# EAGLE design ads1115_shiled (EAGLE 9.3.0)
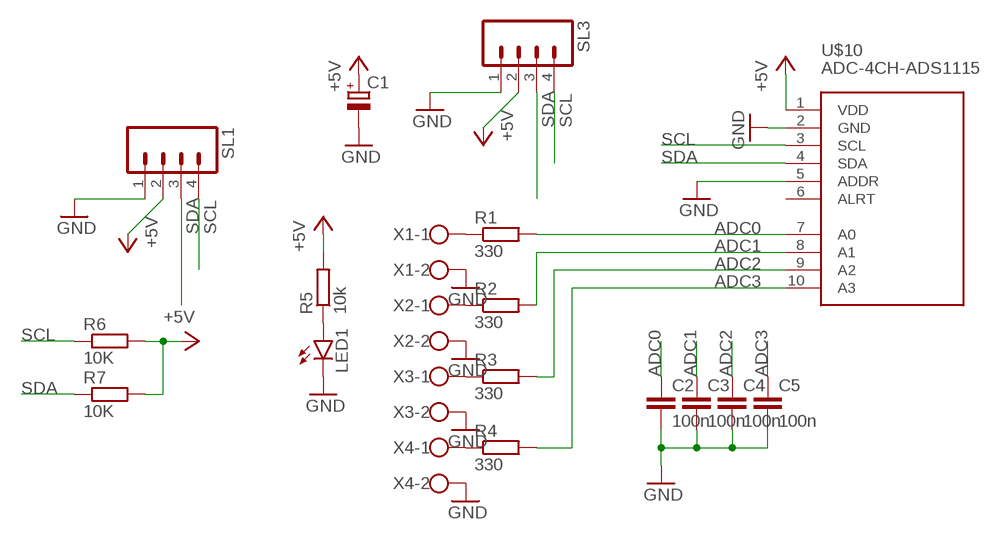
[diagram p0: schematic, sheet 1]

## Parts
C1  CPOL-EUE5-8.5  [E5-8,5]
C2  100n  C-EUC1206  [C1206]
C3  100n  C-EUC1206  [C1206]
C4  100n  C-EUC1206  [C1206]
C5  100n  C-EUC1206  [C1206]
LED1  LED3MM  [LED3MM]
R1  330  R-EU_M1206  [M1206]
R2  330  R-EU_M1206  [M1206]
R3  330  R-EU_M1206  [M1206]
R4  330  R-EU_M1206  [M1206]
R5  10k  R-EU_M1206  [M1206]
R6  10K  R-EU_M1206  [M1206]
R7  10K  R-EU_M1206  [M1206]
SL1  M04  [04P]
SL3  M04  [04P]
U$10  ADC-4CH-ADS1115  [ADC-4CH-ADS1115]
X1  W237-102  [W237-102]
X2  W237-102  [W237-102]
X3  W237-102  [W237-102]
X4  W237-102  [W237-102]

## Nets
+5V: C1.+ R5.2 R6.2 R7.2 SL1.2 SL3.2 U$10.1(VDD)
ADC0: C2.1 R1.2 U$10.7(A0)
ADC1: C3.1 R2.2 U$10.8(A1)
ADC2: C4.1 R3.2 U$10.9(A2)
ADC3: C5.1 R4.2 U$10.10(A3)
GND: C1.- C2.2 C3.2 C4.2 C5.2 LED1.K(C) SL1.1 SL3.1 U$10.2(GND) U$10.5(ADDR) X1.2 X2.2 X3.2 X4.2
N$1: R1.1 X1.1
N$2: R2.1 X2.1
N$3: R3.1 X3.1
N$4: R4.1 X4.1
N$5: LED1.A R5.1
SCL: R6.1 SL1.4 SL3.4 U$10.3(SCL)
SDA: R7.1 SL1.3 SL3.3 U$10.4(SDA)
Unconnected: U$10.6(ALRT)

## Library data of the parts
C1 = rcl:CPOL-EU: POLARIZED CAPACITOR, European symbol; SPICEPREFIX: C
C2-C5 = rcl:C-EU: CAPACITOR, European symbol; SPICEPREFIX: C
LED1 = led:LED: LED OSRAM: - CHIPLED LG R971, LG N971, LY N971, LG Q971, LY Q971, LO R971, LY R971 LH N974, LH R974 LS Q976, LO Q976, LY Q976 LO Q996 - Hyper CHIPLED LW Q18S LB Q993, LB Q99A, LB R99A - SideLED LS A670, LO A670, LY A670, LG A670, LP A670 LB A673, LV A673, LT A673, LW A673 LH A674 LY A675 LS A676, LA A676, LO A676, LY A676, LW A676 LS A679, LY A679, LG A679 - Hyper Micro SIDELED® LS Y876, LA Y876, LO Y876, LY Y876 LT Y87S - SmartLED LW L88C, LW L88S LB L89C, LB L89S, LG L890 LS L89K, LO L89K, LY L89K LS L896, LA L896, LO L896, LY L896 - TOPLED LS T670, LO T670, LY T670, LG T670, LP T670 LSG T670, LSP T670, LSY T670, LOP T670, LYG T670 LG T671, LOG T671, LSG T671 LB T673, LV T673, LT T673, LW T673 LH T674 LS T676, LA T676, LO T676, LY T676, LB T676, LH T676, LSB T676, LW T676 LB T67C, LV T67C, LT T67C, LS T67K, LO T67K, LY T67K, LW E67C LS E67B, LA E67B, LO E67B, LY E67B, LB E67C, LV E67C, LT E67C LW T67C LS T679, LY T679, LG T679 LS T770, LO T770, LY T770, LG T770, LP T770 LB T773, LV T773, LT T773, LW T773 LH T774 LS E675, LA E675, LY E675, LS T675 LS T776, LA T776, LO T776, LY T776, LB T776 LHGB T686 LT T68C, LB T68C - Hyper Mini TOPLED® LB M676 - Mini TOPLED Santana® LG M470 LS M47K, LO M47K, LY M47K Source: http://www.osram.convergy.de LUXEON: - LUMILED® LXK2-PW12-R00, LXK2-PW12-S00, LXK2-PW14-U00, LXK2-PW14-V00 LXK2-PM12-R00, LXK2-PM12-S00, LXK2-PM14-U00 LXK2-PE12-Q00, LXK2-PE12-R00, LXK2-PE12-S00, LXK2-PE14-T00, LXK2-PE14-U00 LXK2-PB12-K00, LXK2-PB12-L00, LXK2-PB12-M00, LXK2-PB14-N00, LXK2-PB14-P00, LXK2-PB14-Q00 LXK2-PR12-L00, LXK2-PR12-M00, LXK2-PR14-Q00, LXK2-PR14-R00 LXK2-PD12-Q00, LXK2-PD12-R00, LXK2-PD12-S00 LXK2-PH12-R00, LXK2-PH12-S00 LXK2-PL12-P00, LXK2-PL12-Q00, LXK2-PL12-R00 Source: www.luxeon.com KINGBRIGHT: KA-3528ASYC Source: www.kingbright.com
R1-R7 = rcl:R-EU_: RESISTOR, European symbol; SPICEPREFIX: R
SL1 SL3 = con-amp-quick:M04: AMP QUICK CONNECTOR; OC_FARNELL: unknown; OC_NEWARK: unknown
U$10 = diy-modules:ADC-4CH-ADS1115: 4 Channel 16-Bit Analog-to-Digital Converter based on ADS1115 chip Arduino ADS1115 Getting Started Tutorial is available here: http://henrysbench.capnfatz.com/henrys-bench/arduino-voltage-measurements/arduino-ads1115-module-getting-started-tutorial/ ADS1115 datasheet is available here: http://www.ti.com/lit/ds/symlink/ads1115.pdf Click here to find device on ebay.com <http://www.ebay.com/sch/ads1115+module>
X1-X4 = con-wago-500-edit:W237-102: WAGO SCREW CLAMP; MPN: 237-102; OC_FARNELL: unknown; OC_NEWARK: 70K9898

## Net classes
0 default: width 0.152 mm, drill 0.152 mm, clearance 0.762 mm

## Board
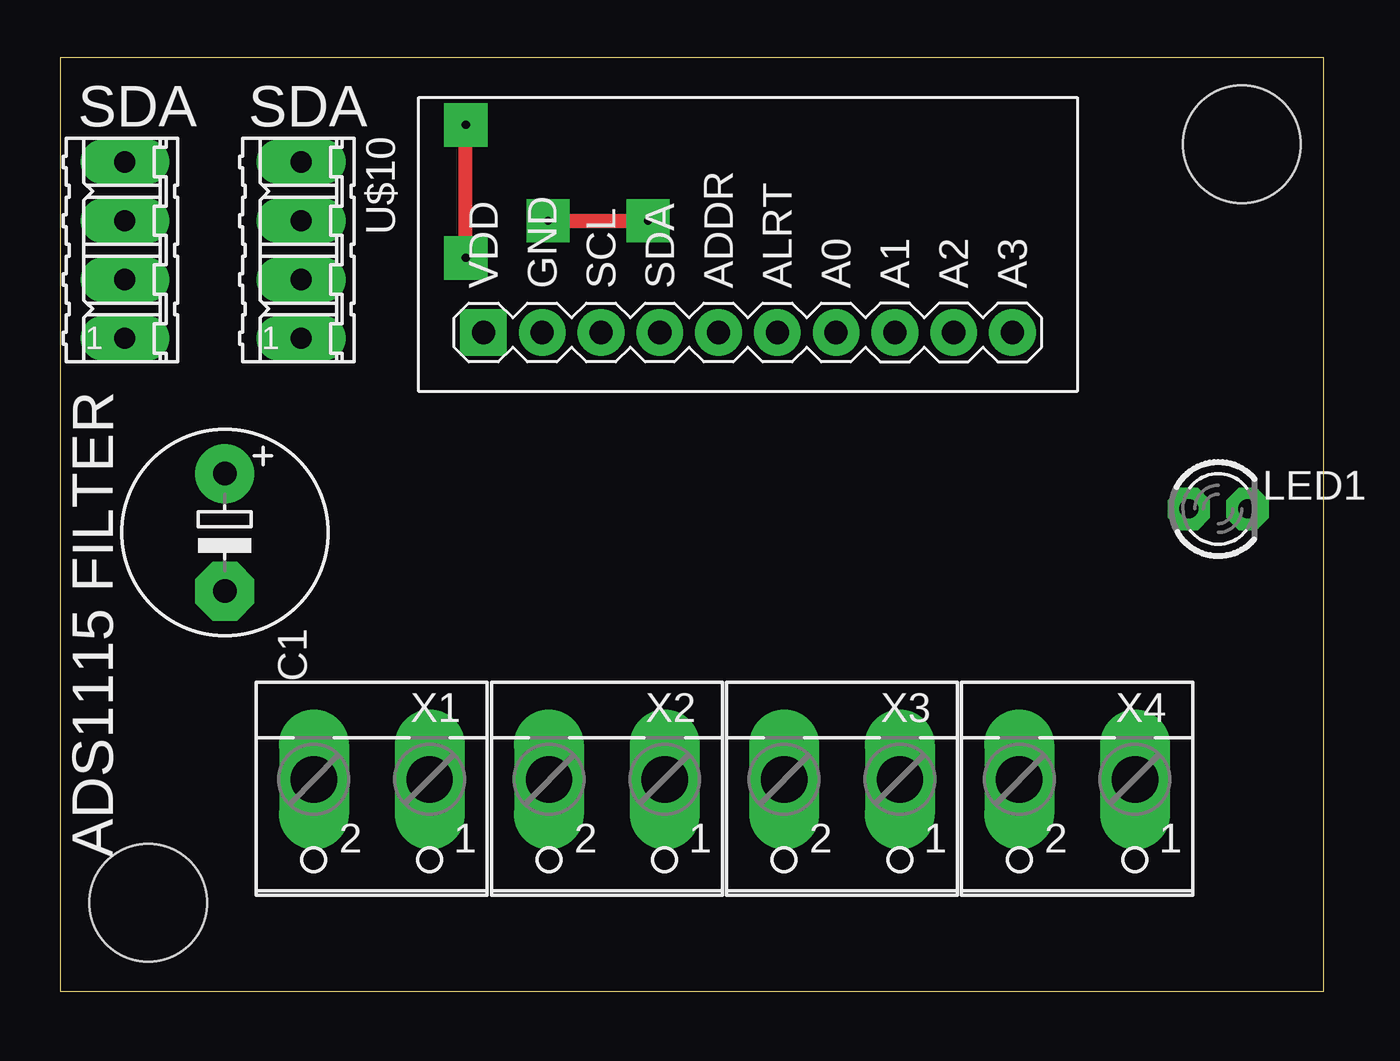
[diagram p1: board, top side]
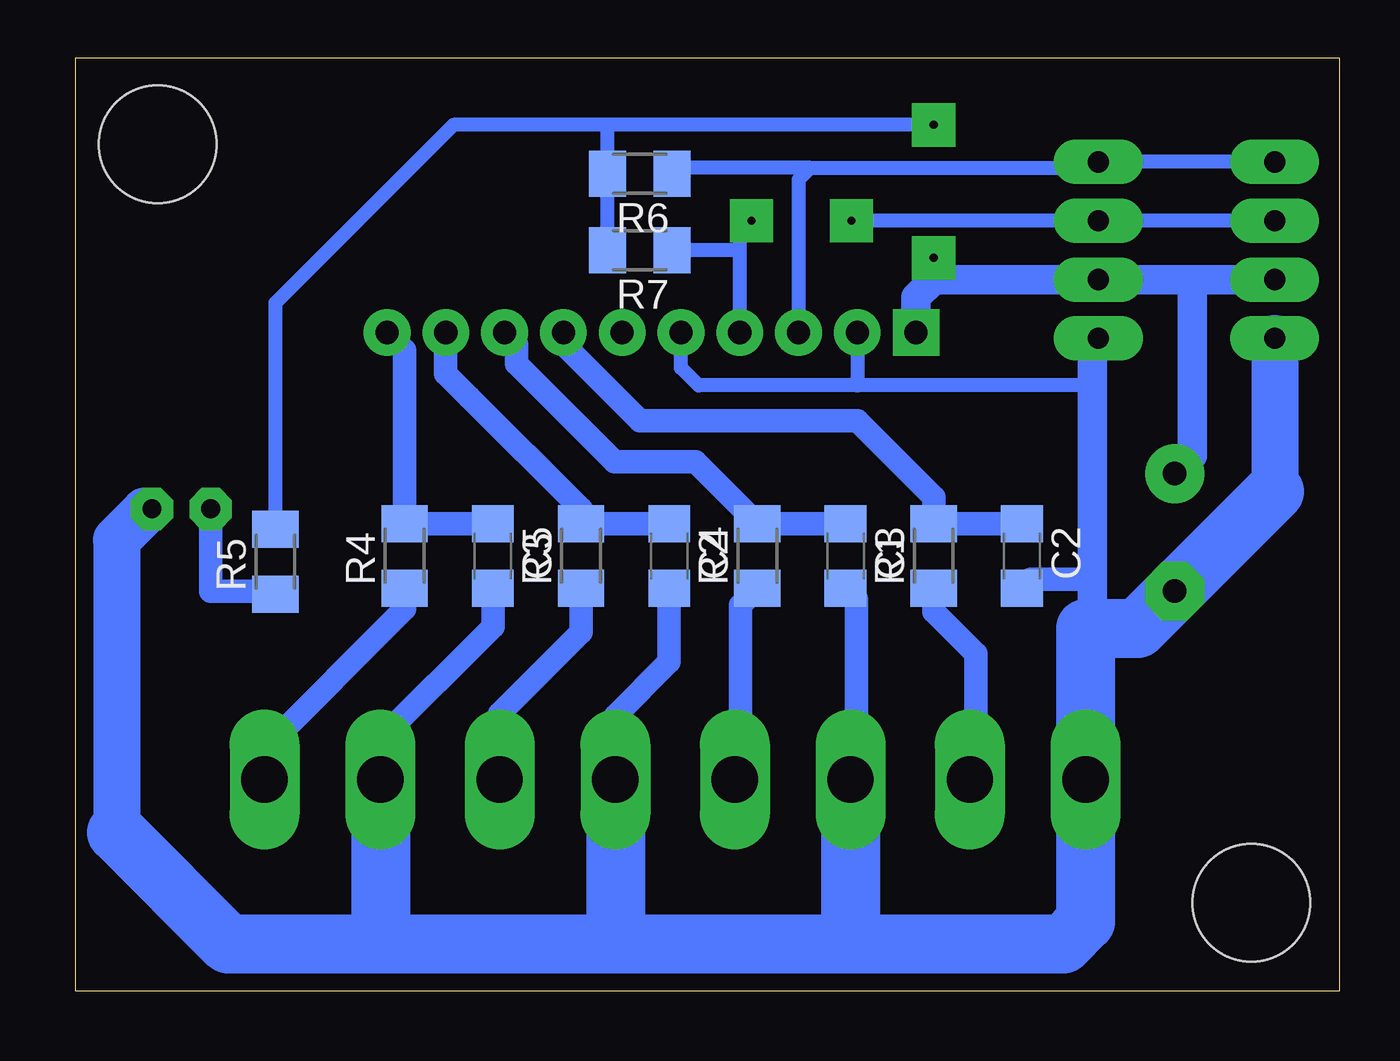
[diagram p2: board, bottom side, seen from below]

Size 54.59 x 40.31 mm. Coordinates in mm from the lower left corner, seen from the top.
Outline: 0,0 54.59,0 54.59,40.31 0,40.31 0,0
Copper layers (1*16): Top 0.035mm / dielectric 1.5mm / Bottom 0.035mm
Design rules "setting": minimum track width 16mil, minimum drill 25mil, track to track 30mil, track to pad 30mil, pad to pad 30mil, via to via 30mil, smd to smd 8mil, copper to edge 50mil, drill to drill 30mil, minimum pad ring 20mil, minimum via ring 30mil, stop-mask expansion 0mil, vias tented up to drill 0mil, thermal gap 10mil
Holes 5.08 mm at 51.05,36.58 3.81,3.81

### Footprints (pad centres in the part's own frame; a part is rotated, then mirrored left to right if it is on the bottom)
E5-8,5 = drill 1.016 pad 2.54: + -2.54,0 | drill 1.016 pad 2.54 octagon: - 2.54,0
C1206 = smd 1.6 x 1.8: 1 -1.4,0; 2 1.4,0
LED3MM = drill 0.813 octagon: A -1.27,0; K 1.27,0
M1206 = smd 1.6 x 2: 1 -1.4,0; 2 1.4,0
04P = drill 0.914 long: 1 -3.81,0; 2 -1.27,0; 3 1.27,0; 4 3.81,0
ADC-4CH-ADS1115 = drill 1 square: 1 -6.35,11.43 | drill 1: 2 -6.35,8.89; 3 -6.35,6.35; 4 -6.35,3.81; 5 -6.35,1.27; 6 -6.35,-1.27; 7 -6.35,-3.81; 8 -6.35,-6.35; 9 -6.35,-8.89; 10 -6.35,-11.43
W237-102 = drill 2 long: 1 -2.5,-1.27; 2 2.5,-1.27

### Placement (x,y rotation side)
C1  7.11,19.81 270 top
C2  13.72,18.8 270 bottom
C3  21.34,18.8 270 bottom
C4  28.96,18.8 270 bottom
C5  36.58,18.8 270 bottom
LED1  50.04,20.83 0 top
R1  17.53,18.8 90 bottom
R2  25.15,18.8 90 bottom
R3  32.77,18.8 90 bottom
R4  40.39,18.8 90 bottom
R5  45.97,18.54 90 bottom
R6  30.23,35.31 180 bottom
R7  30.23,32 180 bottom
SL1  2.79,32 90 top
SL3  10.41,32 90 top
U$10  29.72,34.8 90 top
X1  13.46,7.87 180 top
X2  23.62,7.87 180 top
X3  33.78,7.87 180 top
X4  43.94,7.87 180 top

### Tracks (layer width: path | path; a pad name or v marks a point on that pad's centre or on a via)
+5V  (via drill 0.35)
  Top 0.61: v17.53,31.67 v17.53,37.42
  Bottom 0.61: v17.53,37.42 31.5,37.42 | 31.5,37.42 38.28,37.42 45.97,29.72 R5.2 | 6.35,30.48 6.6,30.73 | 31.5,37.42 31.63,37.29 R6.2 R7.2
  Bottom 1.27: 17.53,30.73 SL3.2 6.6,30.73 SL1.2 | 17.53,30.73 18.29,29.97 U$10.1 | 17.53,30.73 v17.53,31.67 | C1.+ 6.35,23.11 6.35,30.48
ADC0
  Bottom 1.016: C2.1 R1.2 17.53,21.34 20.83,24.64 30.23,24.64 33.53,27.94 U$10.7
ADC1
  Bottom 1.016: U$10.8 35.55,27.93 35.55,27.1 31.31,22.86 27.81,22.86 R2.2 C3.1
ADC2
  Bottom 1.016: C4.1 R3.2 32.77,20.83 37.59,25.65 38.61,26.67 U$10.9
ADC3
  Bottom 1.016: U$10.10 40.39,27.69 R4.2 C5.1
GND
  Bottom 0.61: 10.67,26.42 10.92,26.16 20.83,26.16 | U$10.5 28.45,26.92 27.69,26.16 20.83,26.16 | U$10.2 20.83,26.42 20.83,26.16
  Bottom 1.016: 41.4,9.1 X4.2 41.44,10.88 36.58,15.75 C5.2 | 31.28,2.07 31.24,2.03 | 21.12,2.5 21.59,2.03 | C3.2 20.87,16.93 20.87,9.4 X2.2 | X3.2 31.28,11.9 28.96,14.22 C4.2 | LED1.K 51.41,20.73 51.6,20.73 | 10.96,15.66 10.67,15.95 | C2.2 13.33,17.78 10.67,17.78
  Bottom 1.27: 10.67,15.95 10.67,17.78 10.67,26.42 10.67,27.94 SL3.1
  Bottom 2.032: 51.6,20.73 52.83,19.49 52.83,6.86 | SL1.1 2.79,21.59
  Bottom 2.54: 41.4,2.16 41.4,9.1 | X3.2 31.28,2.07 | X2.2 21.12,2.5 | 52.83,6.86 48.01,2.03 31.24,2.03 21.59,2.03 11.94,2.03 10.96,3.01 X1.2 10.96,15.66 8.73,15.66 C1.- 2.79,21.59
N$1
  Bottom 1.016: R1.1 17.53,16.38 15.71,14.56 15.71,9.4 X1.1
N$2
  Bottom 1.016: X2.1 25.87,9.4 25.87,16.67 R2.1
N$3
  Bottom 1.016: X3.1 36.28,11.98 32.77,15.49 R3.1
N$4
  Bottom 1.016: X4.1 46.44,10.45 40.39,16.51 R4.1
N$5
  Bottom 1.016: LED1.A 48.77,17.27 46.1,17.27 R5.1
SCL
  Bottom 0.61: 22.86,35.56 10.67,35.56 SL3.4 SL1.4 | U$10.3 23.37,35.05 22.86,35.56 | 22.86,35.56 28.57,35.56 R6.1
SDA  (via drill 0.35)
  Top 0.61: v21.08,33.27 v25.4,33.27
  Bottom 0.61: v21.08,33.27 SL3.3 SL1.3 | v25.4,33.27 25.91,32.77 25.91,32 | 25.91,32 U$10.4 | 25.91,32 R7.1

### Text on the board
tPlace: SDA | SDA | ADS1115 FILTER